# Altium schematic sheet Actuators.SchDoc
size A; DocumentNumber: 4; SheetNumber: 4; SheetTotal: 5
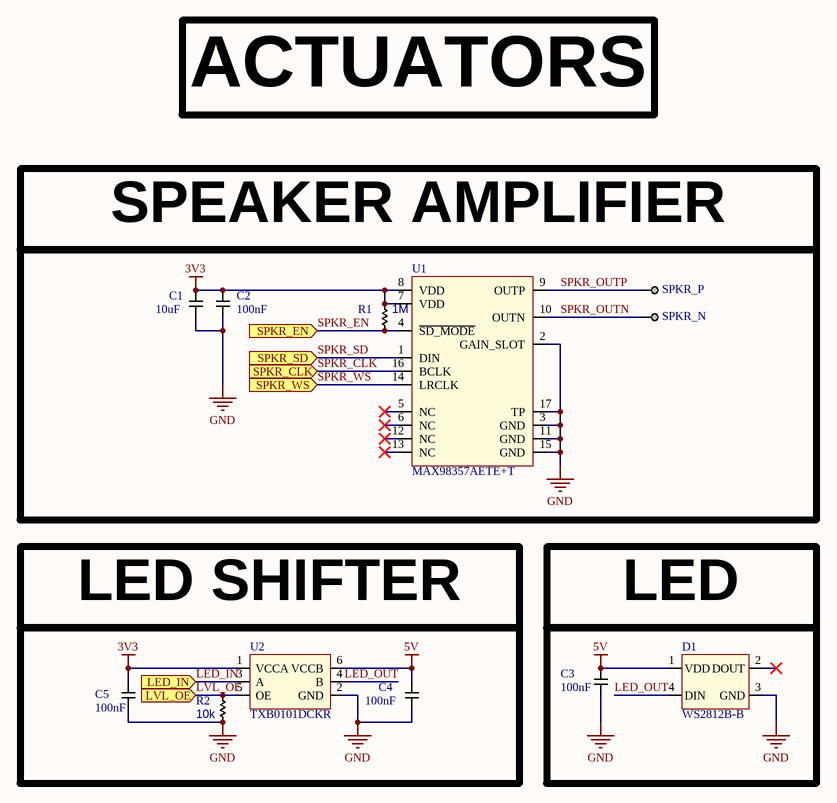
[diagram p0: Actuators.SchDoc]

## Parts
C1  10uF  [CAP_0603_HIGH]
C2  100nF  [CAP_0402_HIGH]
C3  100nF  [CAP_0402_HIGH]
C4  100nF  [CAP_0402_HIGH]
C5  100nF  [CAP_0402_HIGH]
D1  WS2812B-B  [WS2812B-B]
R1  1M  [RES_0402_HIGH]
R2  10k  [RES_0402_HIGH]
SPKR_N  0.1" Header  [0.1" Header]  (value not drawn)  (no BOM)
SPKR_P  0.1" Header  [0.1" Header]  (value not drawn)  (no BOM)
U1  MAX98357AETE+T  [MAX98357AETE+T]
U2  TXB0101DCKR  [TXB0101DCKR]

## Ports
LED_IN (in), LVL_OE (in), SPKR_CLK (in), SPKR_EN (in), SPKR_SD (in), SPKR_WS (in)

## Nets
3V3: C1.2 C2.2 C5.2 R1.2 U1.7(VDD) U1.8(VDD) U2.1(VCCA)
5V: C3.2 C4.2 D1.1(VDD) U2.6(VCCB)
GND: C1.1 C2.1 C3.1 C4.1 C5.1 D1.3(GND) R2.1 U1.2(GAIN_SLOT) U1.3(GND) U1.11(GND) U1.15(GND) U1.17(TP) U2.2(GND)
LED_IN: U2.3(A) ; port LED_IN
LED_OUT: D1.4(DIN) U2.4(B)
LVL_OE: R2.2 U2.5(OE) ; port LVL_OE
SPKR_CLK: U1.16(BCLK) ; port SPKR_CLK
SPKR_EN: R1.1 U1.4(~{SD_MODE}) ; port SPKR_EN
SPKR_OUTN: SPKR_N.1 U1.10(OUTN)
SPKR_OUTP: SPKR_P.1 U1.9(OUTP)
SPKR_SD: U1.1(DIN) ; port SPKR_SD
SPKR_WS: U1.14(LRCLK) ; port SPKR_WS

Not connected (* = marked no-connect by the designer): D1 2(DOUT)*; U1 5(NC)* 6(NC)* 12(NC)* 13(NC)*

## Notes on the sheet
- ACTUATORS
- SPEAKER AMPLIFIER
- LED SHIFTER
- LED

## Library data of the parts
C1 = Capacitor_0603: 0603 Capacitor
C2-C5 = Capacitor_0402: 0402 Capacitor
D1 = WS2812B-B: WS2812B-B RGB 620~630nm Red, 515~530nm Green, 465~475nm Blue SMD,5x5mm Light Emitting Diodes (LED) ROHS
R1 R2 = Resistor_0402: 0402 Resistor
U1 = MAX98357AETE+T: MAX98357AETE+T Amplifier IC 1-Channel (Mono) Class D 16-TQFN (3x3)
U2 = TXB0101DCKR: TXB0101DCKR Voltage Level Translator Bidirectional 1 Circuit 1 Channel 100Mbps SC-70-6